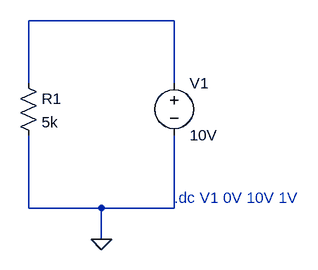
[diagram p0: schematic Ohms_Law.asc]
Ohms_Law.asc, the LTspice schematic file:
Version 4.1
SHEET 1 880 680
WIRE 320 32 96 32
WIRE 96 128 96 32
WIRE 320 128 320 32
WIRE 96 320 96 208
WIRE 208 320 96 320
WIRE 320 320 320 208
WIRE 320 320 208 320
WIRE 208 368 208 320
FLAG 208 368 0
SYMBOL res 80 112 R0
SYMATTR InstName R1
SYMATTR Value 5k
SYMBOL voltage 320 112 R0
WINDOW 123 0 0 Left 0
WINDOW 39 0 0 Left 0
SYMATTR InstName V1
SYMATTR Value 10V
TEXT 320 304 Left 2 ;.dc V1 0V 10V 1V

The netlist it stands for:
* Ohms_Law.asc
R1 N001 0 5k
V1 N001 0 10V
* .dc V1 0V 10V 1V
.backanno
.end